# Altium schematic sheet USB2-C-INTERFACE-EMI-ESD.SchDoc
size A3; ApprovedBy: SI; CheckedBy: SI; Author: SI; CompanyName: KundenName; DrawnBy: SI; Engineer: SI; Organization: Sven Ingelfinger IT-Trainer; Address1: Ruländerstraße 5; Address2: 74235; Address3: Erlenbach; SheetNumber: 2; SheetTotal: 8; OrganizationDescription: Altium Trainer & Consultant
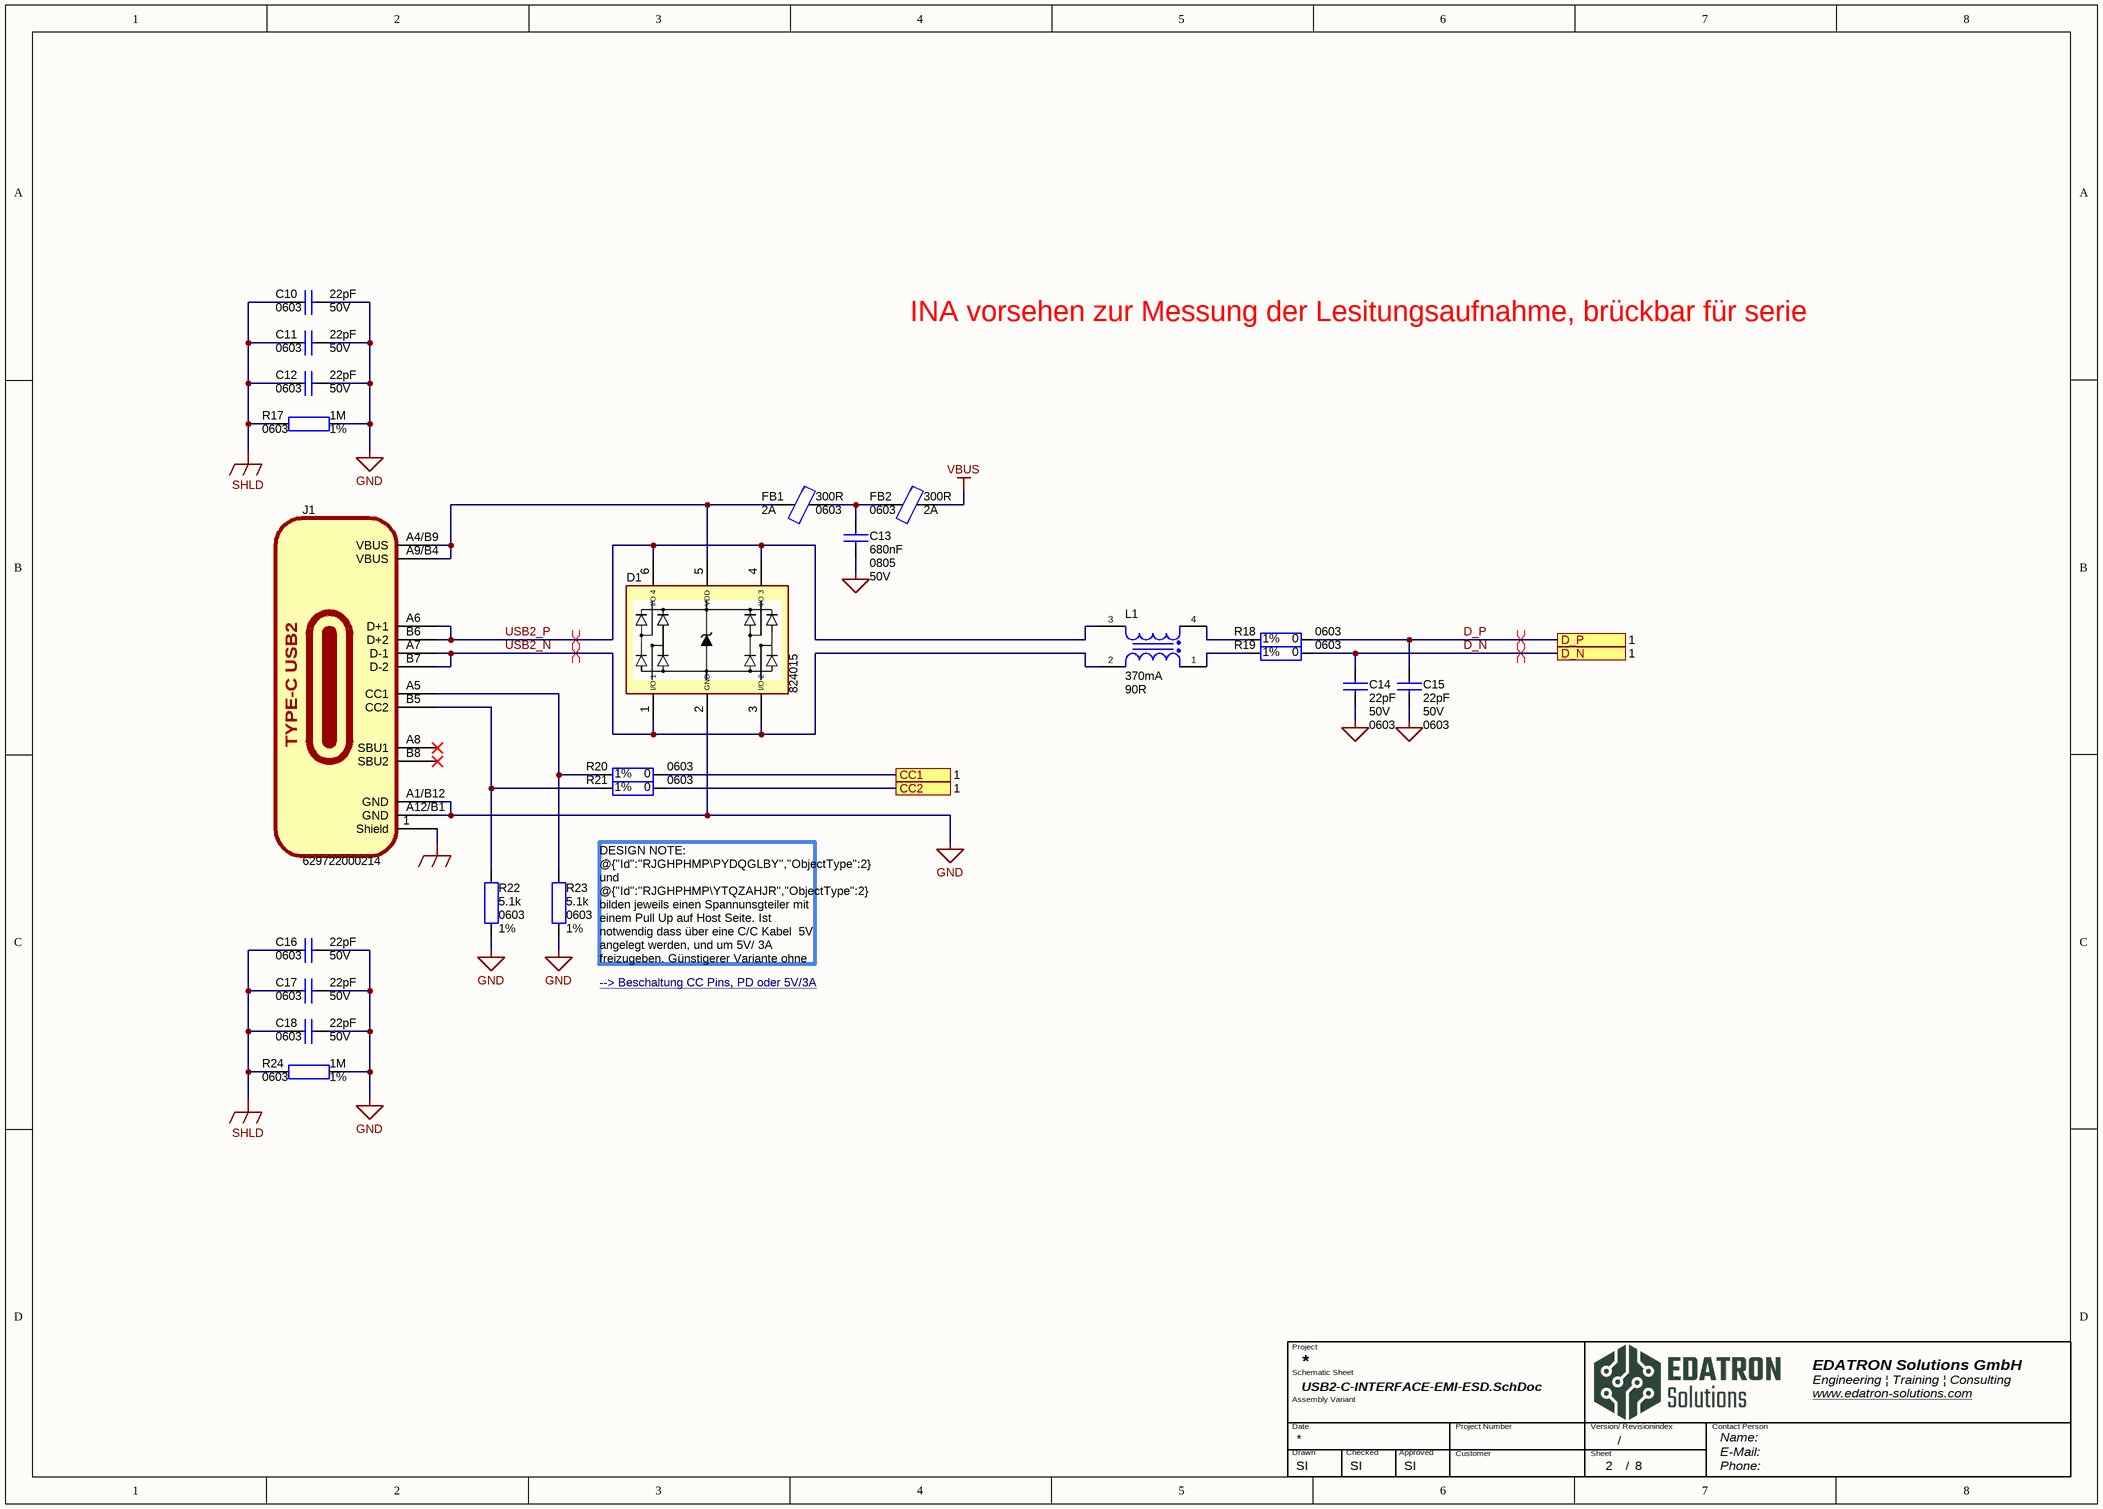
[diagram p0: USB2-C-INTERFACE-EMI-ESD.SchDoc]

## Parts
C10  value 22pF  Voltage: 50V  Case/Package: 0603  [CAPC0603X37L]  (hidden comment: C0603C220K5RACTU)
C11  value 22pF  Voltage: 50V  Case/Package: 0603  [CAPC0603X37L]  (hidden comment: C0603C220K5RACTU)
C12  value 22pF  Voltage: 50V  Case/Package: 0603  [CAPC0603X37L]  (hidden comment: C0603C220K5RACTU)
C13  value 680nF  Case/Package: 0805  Voltage: 50V  [CAPC0805X57L]  (hidden comment: C0805C684K5RACTU)
C14  value 22pF  Voltage: 50V  Case/Package: 0603  [CAPC0603X37L]  (hidden comment: C0603C220K5RACTU)
C15  value 22pF  Voltage: 50V  Case/Package: 0603  [CAPC0603X37L]  (hidden comment: C0603C220K5RACTU)
C16  value 22pF  Voltage: 50V  Case/Package: 0603  [CAPC0603X37L]  (hidden comment: C0603C220K5RACTU)
C17  value 22pF  Voltage: 50V  Case/Package: 0603  [CAPC0603X37L]  (hidden comment: C0603C220K5RACTU)
C18  value 22pF  Voltage: 50V  Case/Package: 0603  [CAPC0603X37L]  (hidden comment: C0603C220K5RACTU)
D1  824015  [SOT23-6L]
FB1  value 300R  Rated Current: 2A  Case/Package: 0603  [BEADC0603X39L]  (hidden comment: 742792641)
FB2  value 300R  Rated Current: 2A  Case/Package: 0603  [BEADC0603X39L]  (hidden comment: 742792641)
J1  629722000214  [WR-COM USB 2.0_Type C_Horizontal_SMT]
L1  value 90R  Rated Current: 370mA  [744231091-Footprint-1]  (hidden comment: 744231091)
R17  value 1M  Tolerance: 1%  Case/Package: 0603  [RESC0603X21L]  (hidden comment: RC0603FR-071ML)
R18  value 0  Case/Package: 0603  Tolerance: 1%  [RESC0603X21L]  (hidden comment: RC0603FR-070RL)
R19  value 0  Case/Package: 0603  Tolerance: 1%  [RESC0603X21L]  (hidden comment: RC0603FR-070RL)
R20  value 0  Case/Package: 0603  Tolerance: 1%  [RESC0603X21L]  (hidden comment: RC0603FR-070RL)
R21  value 0  Case/Package: 0603  Tolerance: 1%  [RESC0603X21L]  (hidden comment: RC0603FR-070RL)
R22  value 5.1k  Case/Package: 0603  Tolerance: 1%  [RESC0603X21L]  (hidden comment: RC0603FR-075K1L)
R23  value 5.1k  Case/Package: 0603  Tolerance: 1%  [RESC0603X21L]  (hidden comment: RC0603FR-075K1L)
R24  value 1M  Tolerance: 1%  Case/Package: 0603  [RESC0603X21L]  (hidden comment: RC0603FR-071ML)

## Ports
CC1 (see 1), CC2 (see 1), D_N (see 1), D_P (see 1)

## Nets
GND: C10.2 C11.2 C12.2 C13.2 C14.2 C15.2 C16.2 C17.2 C18.2 D1.2(GND) J1.A1/B12(GND) J1.A12/B1(GND) R17.2 R22.2 R23.2 R24.2
SHLD: C10.1 C11.1 C12.1 C16.1 C17.1 C18.1 J1.1(Shield) R17.1 R24.1
VBUS: FB2.2
CC1: R20.2 ; port CC1
CC2: R21.2 ; port CC2
D_N: C14.1 R19.2 ; port D_N
D_P: C15.1 R18.2 ; port D_P
USB2_N: D1.1(I/O_1) D1.3(I/O_2) J1.A7(D-1) J1.B7(D-2) L1.2
USB2_P: D1.4(I/O_3) D1.6(I/O_4) J1.A6(D+1) J1.B6(D+2) L1.3
NetC13_1: C13.1 FB1.2 FB2.1
NetD1_5: D1.5(VDD) FB1.1 J1.A4/B9(VBUS) J1.A9/B4(VBUS)
NetJ1_A5: J1.A5(CC1) R20.1 R23.1
NetJ1_B5: J1.B5(CC2) R21.1 R22.1
NetL1_1: L1.1 R19.1
NetL1_4: L1.4 R18.1

Not connected (* = marked no-connect by the designer): J1 A8(SBU1)* B8(SBU2)*

## Layout directives
differential pair; net class USB2: D_N, D_P, USB2_N, USB2_P

## Notes on the sheet
- INA vorsehen zur Messung der Lesitungsaufnahme, brückbar für serie
- DESIGN NOTE:
  @{"Id":"RJGHPHMP\PYDQGLBY","ObjectType":2} und @{"Id":"RJGHPHMP\YTQZAHJR","ObjectType":2} bilden jeweils einen Spannunsgteiler mit einem Pull Up auf Host Seite. Ist notwendig dass über eine C/C Kabel  5V angelegt werden, und um 5V/ 3A freizugeben. Günstigerer Variante ohne PD-IC.
- --> Beschaltung CC Pins, PD oder 5V/3A <https://hackaday.com/2023/01/04/all-about-usb-c-resistors-and-emarkers/>
- Project
- Schematic Sheet
- EDATRON Solutions GmbH
- Engineering | Training | Consulting
- www.edatron-solutions.com <http://www.edatron-solutions.com>
- Assembly Variant
- Drawn
- Date
- Checked
- Approved
- Project Number
- Customer
- Version/ Revisionindex
- Sheet
- /
- Contact Person
- Name:
- E-Mail:
- Phone:
- (in symbol CMP-00172-10) TYPE-C USB2

## Library data of the parts
C10-C12 C14-C18 = CMP-00050-12: CAPACITOR 22 pF 0603 X7R 50V 10%; Manufacturer 1: Kemet; Comment Designer: can be substituted same values other manufacturer; Operating Temperature (max): 125°C; Manufacturer 1 Part Number: C0603C220K5RACTU; Dielectric: X7R; Tolerance: 10%; Operating Temperature (min): -55°C
C13 = CMP-00155-14: CAPACITOR 680 nF 0805 X7R 50V 10%; Manufacturer 1: Kemet; Comment Designer: can be substituted same values other manufacturer; Dielectric: X7R; Tolerance: 10%; Operating Temperature (min): -55°C; Operating Temperature (max): 125°C; Manufacturer 1 Part Number: C0805C684K5RACTU
D1 = CMP-00187-01: Trans Voltage Suppressor Diode, 5V V(RWM), Unidirectional, 1 Element, Silicon; Manufacturer 1: Würth Elektronik; Case/Package: SOT23-6L; Manufacturer 1 Part Number: 824015; Value: 824015; Operating Temperature (max): 125°C; Voltage: 5V; Operating Temperature (min): -55°C
FB1 FB2 = CMP-00185-02: EMI Suppression Ferrite Bead; Manufacturer 1: Würth Elektronik; Tolerance: 25%; Operating Temperature (min): -55°C; Operating Temperature (max): 125°C; Manufacturer 1 Part Number: 742792641
J1 = CMP-00172-10: USB 2.0_Type C_Horizontal_SMT; pin to pad: 1>1+2+3+4; Manufacturer 1: Würth Elektronik; Case/Package: 629722000214; Operating Temperature (max): 85°C; Value: 629722000214; Operating Temperature (min): -40°C; Manufacturer 1 Part Number: 629722000214
L1 = CMP-00182-05: WE-CNSW SMT Common Mode Line Filter, 0805; Manufacturer 1: Würth Elektronik; Voltage: 50V; Tolerance: 25%; Operating Temperature (max): 125°C; Case/Package: L x B: 2,00mm x 1,20mm 0805; Operating Temperature (min): -40°C; Manufacturer 1 Part Number: 744231091
R17 R24 = CMP-009-00337-12: RESISTOR 1M 1% 0603 100mW; Manufacturer 1: Yageo; Comment Designer: can be substituted same values other manufacturers; Manufacturer 1 Part Number: RC0603FR-071ML; Operating Temperature (min): -55°C; Operating Temperature (max): 125°C; Power: 100mW
R18-R21 = CMP-009-00178-12: RESISTOR 0R 1% 0603 100mW; Manufacturer 1: Yageo; Comment Designer: can be substituted same values other manufacturers; Manufacturer 1 Part Number: RC0603FR-070RL; Power: 100mW; Operating Temperature (min): -55°C; Operating Temperature (max): 125°C
R22 R23 = CMP-00189-01: RESISTOR 5K1 1% 0603 100mW; Manufacturer 1: Yageo; Comment Designer: can be substituted same values other manufacturers; Operating Temperature (min): -55°C; Operating Temperature (max): 155°C; Power: 100mW; Manufacturer 1 Part Number: RC0603FR-075K1L